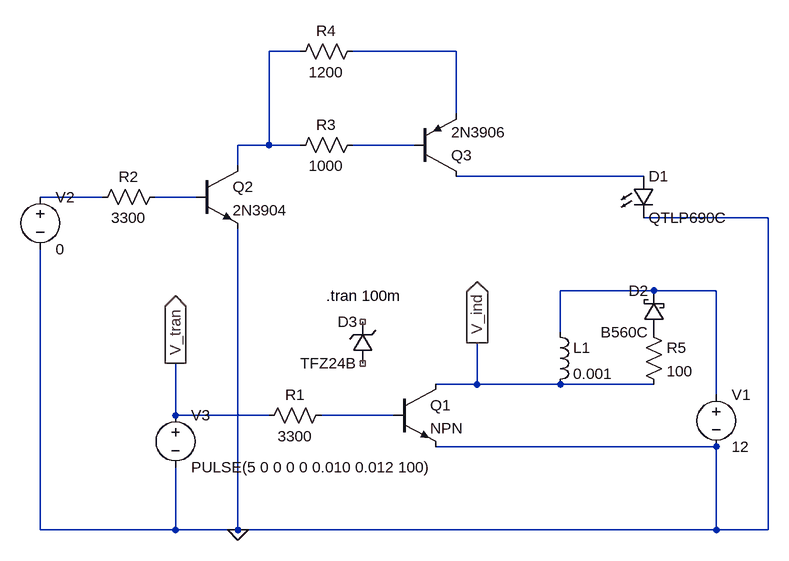
[diagram p0: schematic horn_simulations.asc]
horn_simulations.asc, the LTspice schematic file:
Version 4
SHEET 1 880 680
WIRE -128 -128 -176 -128
WIRE 112 -128 -48 -128
WIRE 112 -32 112 -128
WIRE -176 16 -176 -128
WIRE -176 16 -224 16
WIRE -128 16 -176 16
WIRE 48 16 -48 16
WIRE -224 48 -224 16
WIRE 400 64 112 64
WIRE -432 96 -528 96
WIRE -288 96 -352 96
WIRE 592 128 400 128
WIRE 416 240 272 240
WIRE 512 240 416 240
WIRE 272 304 272 240
WIRE 144 384 144 320
WIRE 144 384 80 384
WIRE 272 384 144 384
WIRE 416 384 272 384
WIRE 512 400 512 240
WIRE -320 432 -320 352
WIRE -176 432 -320 432
WIRE 16 432 -96 432
WIRE 512 480 80 480
WIRE -528 608 -528 176
WIRE -320 608 -320 512
WIRE -320 608 -528 608
WIRE -224 608 -224 144
WIRE -224 608 -320 608
WIRE 512 608 512 480
WIRE 512 608 -224 608
WIRE 592 608 592 128
WIRE 592 608 512 608
FLAG -224 608 0
FLAG -320 352 V_tran
IOPIN -320 352 Out
FLAG 144 320 V_ind
IOPIN 144 320 Out
SYMBOL ind 256 288 R0
SYMATTR InstName L1
SYMATTR Value 0.001
SYMATTR SpiceLine Rser=3
SYMBOL npn 16 384 R0
SYMATTR InstName Q1
SYMBOL npn -288 48 R0
SYMATTR InstName Q2
SYMATTR Value 2N3904
SYMBOL voltage 512 384 R0
SYMATTR InstName V1
SYMATTR Value 12
SYMATTR SpiceLine Rser=0
SYMBOL res -80 416 R90
WINDOW 0 0 56 VBottom 2
WINDOW 3 32 56 VTop 2
SYMATTR InstName R1
SYMATTR Value 3300
SYMBOL res -336 80 R90
WINDOW 0 0 56 VBottom 2
WINDOW 3 32 56 VTop 2
SYMATTR InstName R2
SYMATTR Value 3300
SYMBOL res -32 0 R90
WINDOW 0 0 56 VBottom 2
WINDOW 3 32 56 VTop 2
SYMATTR InstName R3
SYMATTR Value 1000
SYMBOL res -32 -144 R90
WINDOW 0 0 56 VBottom 2
WINDOW 3 32 56 VTop 2
SYMATTR InstName R4
SYMATTR Value 1200
SYMBOL pnp 48 64 M180
SYMATTR InstName Q3
SYMATTR Value 2N3906
SYMBOL LED 384 64 R0
SYMATTR InstName D1
SYMATTR Value QTLP690C
SYMBOL voltage -528 80 R0
SYMATTR InstName V2
SYMATTR Value 0
SYMATTR SpiceLine Rser=1
SYMBOL voltage -320 416 R0
SYMATTR InstName V3
SYMATTR Value PULSE(5 0 0 0 0 0.010 0.012 100)
SYMBOL schottky 432 304 R180
WINDOW 0 24 64 Left 2
WINDOW 3 24 0 Left 2
SYMATTR InstName D2
SYMATTR Value B560C
SYMATTR Description Diode
SYMATTR Type diode
SYMBOL zener -16 352 R180
WINDOW 0 24 64 Left 2
WINDOW 3 24 0 Left 2
SYMATTR InstName D3
SYMATTR Value TFZ24B
SYMATTR Description Diode
SYMATTR Type diode
SYMBOL res 400 288 R0
SYMATTR InstName R5
SYMATTR Value 100
TEXT -88 248 Left 2 !.tran 100m

The netlist it stands for:
* horn_simulations.asc
L1 N007 V_ind 0.001 Rser=3
Q1 V_ind N008 0 0 NPN
Q2 N001 N006 0 0 2N3904
V1 N007 0 12 Rser=0
R1 N008 V_tran 3300
R2 N006 N005 3300
R3 N003 N001 1000
R4 N002 N001 1200
Q3 N004 N003 N002 0 2N3906
D1 N004 0 QTLP690C
V2 N005 0 0 Rser=1
V3 V_tran 0 PULSE(5 0 0 0 0 0.010 0.012 100)
D2 P001 N007 B560C
D3 NC_01 NC_02 TFZ24B
R5 P001 V_ind 100
.model D D
.lib standard.dio
.model NPN NPN
.model PNP PNP
.lib standard.bjt
.tran 100m
.backanno
.end